# Altium schematic sheet 无线充电装置台原理图.SchDoc
size A4
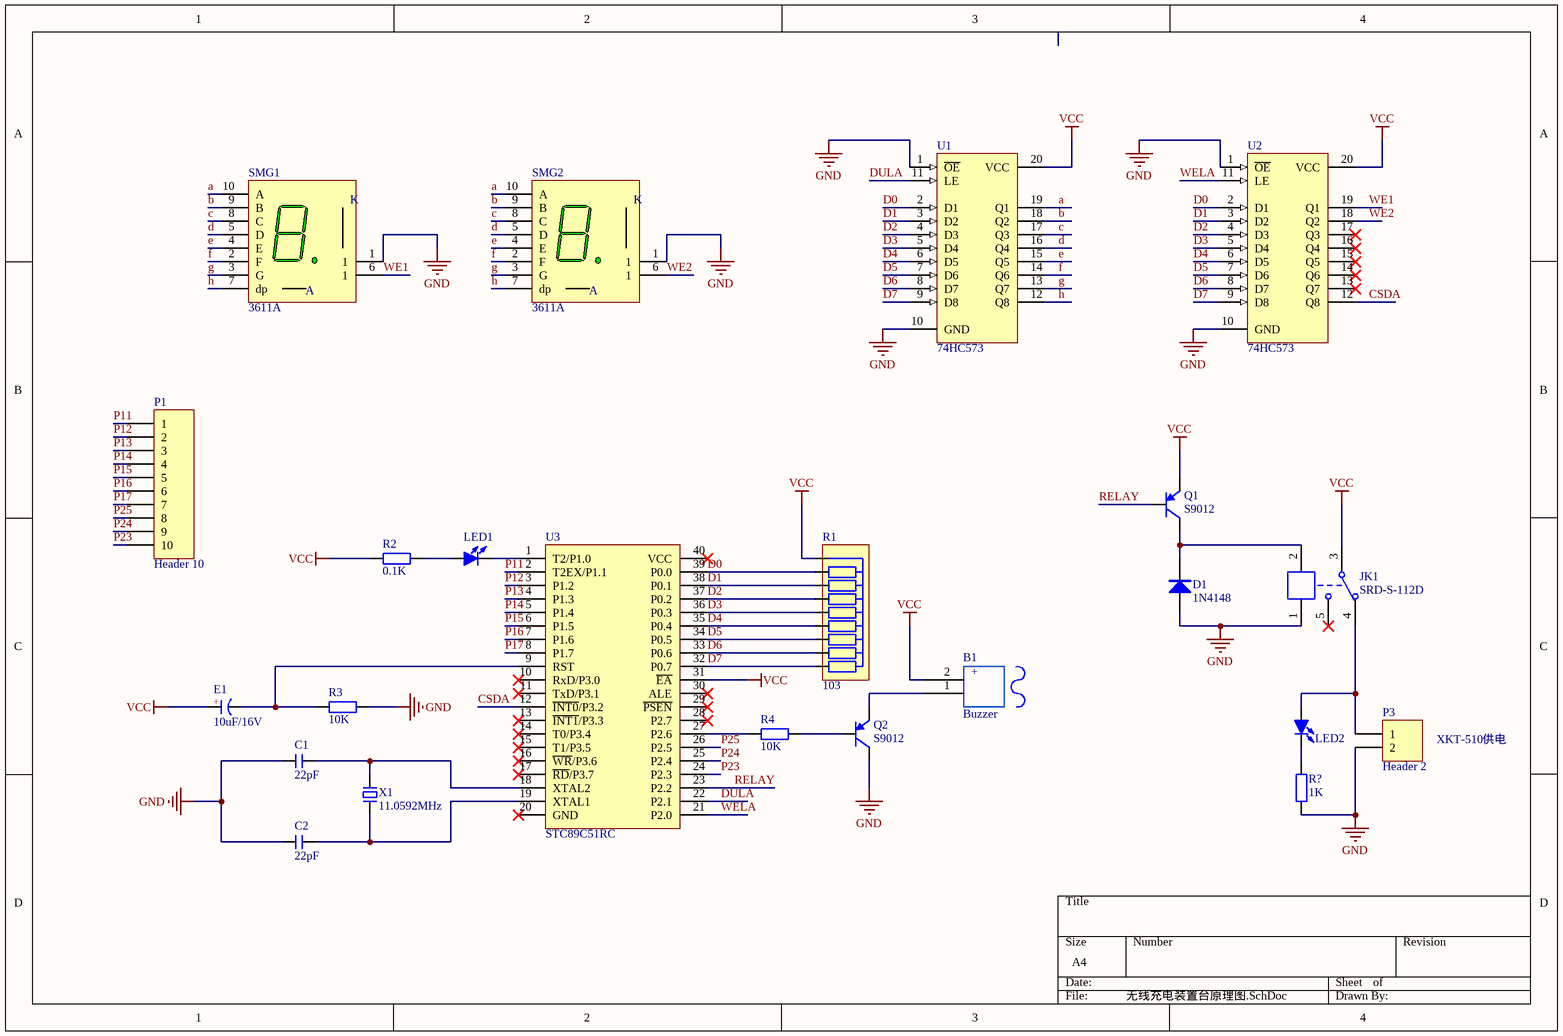
[diagram p0: 无线充电装置台原理图.SchDoc]

## Parts
B1  Buzzer  [蜂鸣器侧装]
C1  22pF  [C0805]
C2  22pF  [C0805]
D1  1N4148  [DO-35]
E1  10uF/16V  [C-DIP2]
JK1  SRD-S-112D  [SRD-C_BK]
LED1  红色  [LED0805]  (value not drawn)
LED2  H  [LED0805]  (value not drawn)
P1  Header 10  [HDR1X10]
P3  Header 2  [HDR1X2]
Q1  S9012  [TO92A]
Q2  S9012  [TO92A]
R1  103  [SIP-9]
R2  0.1K  [0805]
R3  10K  [0805]
R4  10K  [0805]
R?  1K  [0805]
SMG1  3611A  [DIP10-12.6X19]
SMG2  3611A  [DIP10-12.6X19]
U1  74HC573  [SOP20]
U2  74HC573  [SOP20]
U3  STC89C51RC  [DIP40-600]
X1  11.0592MHz  [XTAL-HC49US2]

## Nets
GND: C1.1 C2.1 D1.1(A) JK1.1 P3.2 Q2.3(C) R3.2 R?.1 SMG1.1 SMG2.1 U1.1(~{OE}) U1.10(GND) U2.1(~{OE}) U2.10(GND)
VCC: B1.2 E1.1(A) JK1.3 Q1.1(E) R1.1 R2.1 U1.20(VCC) U2.20(VCC) U3.31(~{EA})
a: SMG1.10(A) SMG2.10(A) U1.19(Q1)
b: SMG1.9(B) SMG2.9(B) U1.18(Q2)
c: SMG1.8(C) SMG2.8(C) U1.17(Q3)
CSDA: U2.12(Q8) U3.12(~{INT0}/P3.2)
d: SMG1.5(D) SMG2.5(D) U1.16(Q4)
D0: R1.2 U1.2(D1) U2.2(D1) U3.39(P0.0)
D1: R1.3 U1.3(D2) U2.3(D2) U3.38(P0.1)
D2: R1.4 U1.4(D3) U2.4(D3) U3.37(P0.2)
D3: R1.5 U1.5(D4) U2.5(D4) U3.36(P0.3)
D4: R1.6 U1.6(D5) U2.6(D5) U3.35(P0.4)
D5: R1.7 U1.7(D6) U2.7(D6) U3.34(P0.5)
D6: R1.8 U1.8(D7) U2.8(D7) U3.33(P0.6)
D7: R1.9 U1.9(D8) U2.9(D8) U3.32(P0.7)
DULA: U1.11(LE) U3.22(P2.1)
e: SMG1.4(E) SMG2.4(E) U1.15(Q5)
f: SMG1.2(F) SMG2.2(F) U1.14(Q6)
g: SMG1.3(G) SMG2.3(G) U1.13(Q7)
h: SMG1.7(dp) SMG2.7(dp) U1.12(Q8)
P11: P1.1 U3.2(T2EX/P1.1)
P12: P1.2 U3.3(P1.2)
P13: P1.3 U3.4(P1.3)
P14: P1.4 U3.5(P1.4)
P15: P1.5 U3.6(P1.5)
P16: P1.6 U3.7(P1.6)
P17: P1.7 U3.8(P1.7)
P23: P1.10 U3.24(P2.3)
P24: P1.9 U3.25(P2.4)
P25: P1.8 U3.26(P2.5)
RELAY: Q1.2(B) U3.23(P2.2)
WE1: SMG1.6(1) U2.19(Q1)
WE2: SMG2.6(1) U2.18(Q2)
WELA: U2.11(LE) U3.21(P2.0)
NetB1_1: B1.1 Q2.1(E)
NetC1_2: C1.2 U3.18(XTAL2) X1.2
NetC2_2: C2.2 U3.19(XTAL1) X1.1
NetD1_2: D1.2(K) JK1.2 Q1.3(C)
NetE1_2: E1.2(K) R3.1 U3.9(RST)
NetJK1_4: JK1.4 LED2.1(A) P3.1
NetLED1_1: LED1.1(A) R2.2
NetLED1_2: LED1.2(K) U3.1(T2/P1.0)
NetLED2_2: LED2.2(K) R?.2
NetQ2_2: Q2.2(B) R4.2
NetR4_1: R4.1 U3.27(P2.6)

Not connected (* = marked no-connect by the designer): JK1 5*; U2 13(Q7)* 14(Q6)* 15(Q5)* 16(Q4)* 17(Q3)*; U3 10(RxD/P3.0)* 11(TxD/P3.1)* 13(~{INT1}/P3.3)* 14(T0/P3.4)* 15(T1/P3.5)* 16(~{WR}/P3.6)* 17(~{RD}/P3.7)* 20(GND)* 28(P2.7)* 29(~{PSEN})* 30(ALE)* 40(VCC)*

## Notes on the sheet
- XKT-510供电
- (in symbol 3611A) K
- (in symbol Buzzer) +
- (in symbol C-CAP) +

## Library data of the parts
C1 C2 = C: 无极性贴片电容; 版权归属: 源创客; BOM名称: 无极性贴片电容; 学习资源: www.ooocke.com
D1 = 1N4148: 高速开关二极管; 版权归属: 源创客; BOM名称: 高速开关二极管; 学习资源: www.ooocke.com
E1 = C-CAP: 直插电解电容; 版权归属: 源创客; BOM名称: 直插电解电容; 学习资源: www.ooocke.com
JK1 = SRD-S-112D: 12V一组转换; BOM名称: 12V继电器; 版权归属: 源创客; 学习资源: www.ooocke.com
LED1 LED2 = LED-3MM: 插件LED; 版权归属: 源创客; BOM名称: 插件LED; 学习资源: www.ooocke.com
P1 = Header 10: Header, 10-Pin; LatestRevisionDate: 17-Jul-2002; LatestRevisionNote: Re-released for DXP Platform.; Publisher: Altium Limited
P3 = Header 2: Header, 2-Pin; LatestRevisionDate: 17-Jul-2002; LatestRevisionNote: Re-released for DXP Platform.; Publisher: Altium Limited
Q1 Q2 = 9012-DIP: 低频放大-PNP型; 版权归属: 源创客; 属性: 50V 0.5A 0.625W; BOM名称: 低频放大-PNP型; 学习资源: www.ooocke.com
R1 = R SIP9: 单列直插排阻; 版权归属: 源创客; BOM名称: 单列直插排阻; 学习资源: www.ooocke.com
R2-R4 R? = R: 贴片电阻; 版权归属: 源创客; BOM名称: 贴片电阻; 学习资源: www.ooocke.com
SMG1 SMG2 = 3611A: 0.36寸1位共阴数码管; 版权归属: 源创客; BOM名称: 0.36寸1位共阴; 学习资源: www.ooocke.com
U1 U2 = 74HC573: D类三态输出锁存器; 版权归属: 源创客; BOM名称: 三态输出锁存器; 学习资源: www.ooocke.com
U3 = STC89C51RC: STC单片机; 版权归属: 源创客; BOM名称: STC单片机; 学习资源: www.ooocke.com
X1 = XTAL-2P: 2脚无源脚晶振; 版权归属: 源创客; BOM名称: 2脚无源脚晶振; 学习资源: www.ooocke.com